# EAGLE design 2CAN (EAGLE 6.4)
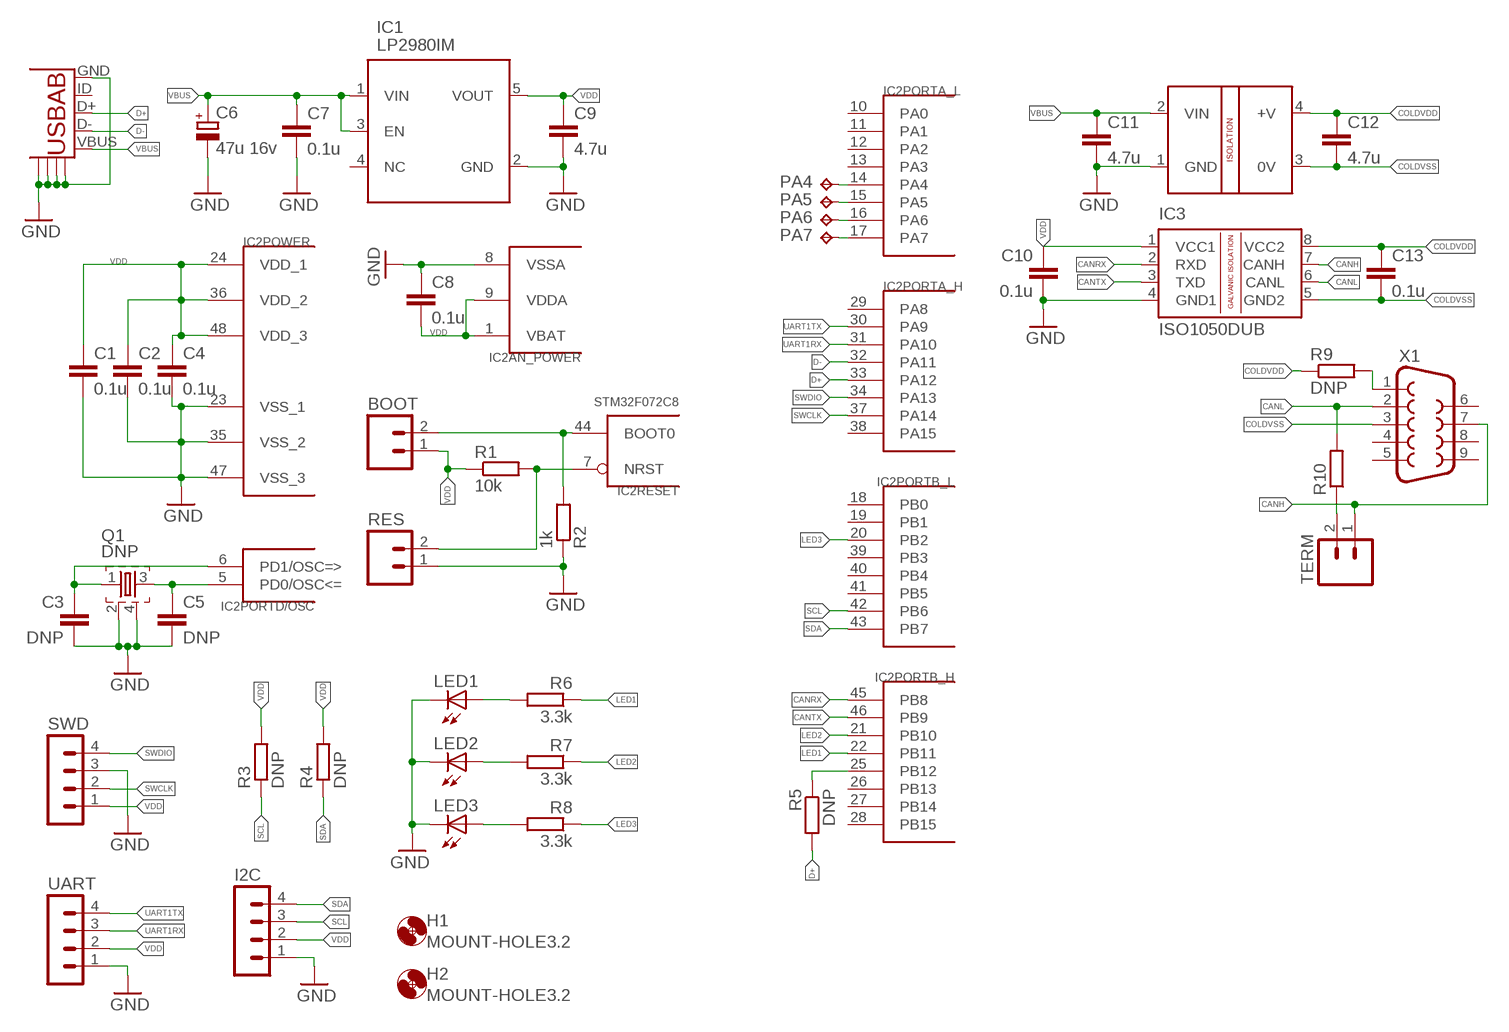
[diagram p0: schematic, sheet 1]

## Parts
BOOT  M02PTH  [1X02]
C1  0.1u  C-EUC0603  [C0603]
C2  0.1u  C-EUC0603  [C0603]
C3  DNP  C-EUC0603  [C0603]
C4  0.1u  C-EUC0603  [C0603]
C5  DNP  C-EUC0603  [C0603]
C6  47u 16v  CPOL-EUE2-5  [E2-5]
C7  0.1u  C-EUC0603  [C0603]
C8  0.1u  C-EUC0603  [C0603]
C9  4.7u  C-EUC0805  [C0805]
C10  0.1u  C-EUC0603  [C0603]
C11  4.7u  C-EUC0805  [C0805]
C12  4.7u  C-EUC0805  [C0805]
C13  0.1u  C-EUC0603  [C0603]
H1  MOUNT-HOLE3.2  [3,2]
H2  MOUNT-HOLE3.2  [3,2]
I2C  MA04-1  [MA04-1]
IC1  LP2980IM  [SOT23-5L]
IC2  STM32F072C8  STM32F10XCXT6  [TQFP48]
IC3  ISO1050DUB  [DUB-R-PDSO-G8]
LED1  LEDSML0603  [SML0603]
LED2  LEDSML0603  [SML0603]
LED3  LEDSML0603  [SML0603]
PA4  TPB1,27  [B1,27]
PA5  TPB1,27  [B1,27]
PA6  TPB1,27  [B1,27]
PA7  TPB1,27  [B1,27]
Q1  DNP  FA-3225  [FA-20H]
R1  10k  R-EU_R0603  [R0603]
R2  1k  R-EU_R0603  [R0603]
R3  DNP  R-EU_R0603  [R0603]
R4  DNP  R-EU_R0603  [R0603]
R5  DNP  R-EU_R0603  [R0603]
R6  3.3k  R-EU_R0603  [R0603]
R7  3.3k  R-EU_R0603  [R0603]
R8  3.3k  R-EU_R0603  [R0603]
R9  DNP  R-EU_R0805  [R0805]
R10  R-EU_R0805  [R0805]
RES  M02PTH  [1X02]
SWD  MA04-1  [MA04-1]
TERM  M02PTH  [1X02]
U$1  USB_AB  [USB-AB-MICRO-SMD]
U$2  B0505SV  [B0505S_V]
UART  MA04-1  [MA04-1]
X1  DB9MALE  [DB9_MALE]

## Nets
CANH: IC3.7(CANH) TERM.1 X1.7
CANL: IC3.6(CANL) R10.2 X1.2
CANRX: IC2.45(PORTB_H:PB8) IC3.2(RXD)
CANTX: IC2.46(PORTB_H:PB9) IC3.3(TXD)
COLDVDD: C12.1 C13.1 IC3.8(VCC2) R9.1 U$2.4(+V)
COLDVSS: C12.2 C13.2 IC3.5(GND2) U$2.3(0V) X1.3
D+: IC2.33(PORTA_H:PA12) R5.2 U$1.D+
D-: IC2.32(PORTA_H:PA11) U$1.D-
GND: C1.2 C2.2 C3.2 C4.2 C5.2 C6.- C7.2 C8.1 C9.2 C10.2 C11.2 I2C.1 IC1.2(GND) IC2.8(AN_POWER:VSSA) IC2.23(POWER:VSS_1) IC2.35(POWER:VSS_2) IC2.47(POWER:VSS_3) IC3.4(GND1) LED1.C LED2.C LED3.C Q1.2 Q1.4 R2.1 RES.1 SWD.3 U$1.GND U$1.GND@1 U$1.GND@2 U$1.GND@3 U$1.GND@4 U$2.1(GND) UART.1
LED1: IC2.22(PORTB_H:PB11) R6.1
LED2: IC2.21(PORTB_H:PB10) R7.1
LED3: IC2.20(PORTB_L:PB2) R8.1
N$1: IC2.7(RESET:NRST) R1.2 RES.2
N$2: BOOT.2 IC2.44(RESET:BOOT0) R2.2
N$3: R9.2 X1.1
N$4: LED1.A R6.2
N$5: LED2.A R7.2
N$6: LED3.A R8.2
N$8: R10.1 TERM.2
N$12: C5.1 IC2.5(PORTD/OSC:PD0/OSC<=) Q1.3
N$13: C3.1 IC2.6(PORTD/OSC:PD1/OSC=>) Q1.1
N$15: IC2.14(PORTA_L:PA4) PA4.TP
N$16: IC2.15(PORTA_L:PA5) PA5.TP
N$17: IC2.16(PORTA_L:PA6) PA6.TP
N$18: IC2.17(PORTA_L:PA7) PA7.TP
SCL: I2C.3 IC2.42(PORTB_L:PB6) R3.1
SDA: I2C.4 IC2.43(PORTB_L:PB7) R4.1
SWCLK: IC2.37(PORTA_H:PA14) SWD.2
SWDIO: IC2.34(PORTA_H:PA13) SWD.4
UART1RX: IC2.31(PORTA_H:PA10) UART.3
UART1TX: IC2.30(PORTA_H:PA9) UART.4
USBPU: IC2.25(PORTB_H:PB12) R5.1
VBUS: C6.+ C7.1 C11.1 IC1.1(VIN) IC1.3(EN) U$1.VBUS U$2.2(VIN)
VDD: BOOT.1 C1.1 C2.1 C4.1 C8.2 C9.1 C10.1 I2C.2 IC1.5(VOUT) IC2.1(AN_POWER:VBAT) IC2.9(AN_POWER:VDDA) IC2.24(POWER:VDD_1) IC2.36(POWER:VDD_2) IC2.48(POWER:VDD_3) IC3.1(VCC1) R1.1 R3.2 R4.2 SWD.1 UART.2
Unconnected: IC1.4(NC) IC2.2(PORTC:PC13) IC2.3(PORTC:PC14) IC2.4(PORTC:PC15) IC2.10(PORTA_L:PA0) IC2.11(PORTA_L:PA1) IC2.12(PORTA_L:PA2) IC2.13(PORTA_L:PA3) IC2.18(PORTB_L:PB0) IC2.19(PORTB_L:PB1) IC2.26(PORTB_H:PB13) IC2.27(PORTB_H:PB14) IC2.28(PORTB_H:PB15) IC2.29(PORTA_H:PA8) IC2.38(PORTA_H:PA15) IC2.39(PORTB_L:PB3) IC2.40(PORTB_L:PB4) IC2.41(PORTB_L:PB5) U$1.ID(USBID) X1.4 X1.5 X1.6 X1.8 X1.9

## Library data of the parts
BOOT RES TERM = untitled:M02: Standard 2-pin 0.1" header. Use with - straight break away headers ( PRT-00116) - right angle break away headers (PRT-00553) - swiss pins (PRT-00743) - machine pins (PRT-00117) - female headers (PRT-00115) Molex polarized connector foot print use with: PRT-08233 with associated crimp pins and housings. 2.54_SCREWTERM for use with PRT-10571. 3.5mm Screw Terminal footprints for PRT-08084 5mm Screw Terminal footprints for use with PRT-08433
C1-C5 C7-C13 = untitled:C-EU: CAPACITOR, European symbol
C6 = untitled:CPOL-EU: POLARIZED CAPACITOR, European symbol
H1 H2 = holes:MOUNT-HOLE: MOUNTING HOLE with drill center marker
I2C SWD UART = untitled:MA04-1: PIN HEADER; OC_FARNELL: unknown; OC_NEWARK: unknown
IC1 = untitled:LP2980
IC2 = untitled:STM32F10XCXT6: ST STM32F101/103 48pin LQFP
IC3 = texas:ISO1050: ISOLATED CAN TRANSCEIVER Source: http://focus.ti.com/lit/ds/symlink/iso1050.pdf; MPN: ISO1050DUBR; OC_FARNELL: 1755712; OC_NEWARK: 14R9899
LED1-LED3 = led:LED: LED OSRAM: - CHIPLED LG R971, LG N971, LY N971, LG Q971, LY Q971, LO R971, LY R971 LH N974, LH R974 LS Q976, LO Q976, LY Q976 LO Q996 - Hyper CHIPLED LW Q18S LB Q993, LB Q99A, LB R99A - SideLED LS A670, LO A670, LY A670, LG A670, LP A670 LB A673, LV A673, LT A673, LW A673 LH A674 LY A675 LS A676, LA A676, LO A676, LY A676, LW A676 LS A679, LY A679, LG A679 - Hyper Micro SIDELED® LS Y876, LA Y876, LO Y876, LY Y876 LT Y87S - SmartLED LW L88C, LW L88S LB L89C, LB L89S, LG L890 LS L89K, LO L89K, LY L89K LS L896, LA L896, LO L896, LY L896 - TOPLED LS T670, LO T670, LY T670, LG T670, LP T670 LSG T670, LSP T670, LSY T670, LOP T670, LYG T670 LG T671, LOG T671, LSG T671 LB T673, LV T673, LT T673, LW T673 LH T674 LS T676, LA T676, LO T676, LY T676, LB T676, LH T676, LSB T676, LW T676 LB T67C, LV T67C, LT T67C, LS T67K, LO T67K, LY T67K, LW E67C LS E67B, LA E67B, LO E67B, LY E67B, LB E67C, LV E67C, LT E67C LW T67C LS T679, LY T679, LG T679 LS T770, LO T770, LY T770, LG T770, LP T770 LB T773, LV T773, LT T773, LW T773 LH T774 LS E675, LA E675, LY E675, LS T675 LS T776, LA T776, LO T776, LY T776, LB T776 LHGB T686 LT T68C, LB T68C - Hyper Mini TOPLED® LB M676 - Mini TOPLED Santana® LG M470 LS M47K, LO M47K, LY M47K Source: http://www.osram.convergy.de LUXEON: - LUMILED® LXK2-PW12-R00, LXK2-PW12-S00, LXK2-PW14-U00, LXK2-PW14-V00 LXK2-PM12-R00, LXK2-PM12-S00, LXK2-PM14-U00 LXK2-PE12-Q00, LXK2-PE12-R00, LXK2-PE12-S00, LXK2-PE14-T00, LXK2-PE14-U00 LXK2-PB12-K00, LXK2-PB12-L00, LXK2-PB12-M00, LXK2-PB14-N00, LXK2-PB14-P00, LXK2-PB14-Q00 LXK2-PR12-L00, LXK2-PR12-M00, LXK2-PR14-Q00, LXK2-PR14-R00 LXK2-PD12-Q00, LXK2-PD12-R00, LXK2-PD12-S00 LXK2-PH12-R00, LXK2-PH12-S00 LXK2-PL12-P00, LXK2-PL12-Q00, LXK2-PL12-R00 Source: www.luxeon.com KINGBRIGHT: KA-3528ASYC Source: www.kingbright.com
PA4-PA7 = testpad:TP: Test pad
Q1 = untitled:FA-: MHz RANGE CRYSTAL UNIT Source: Epson Toyocom
R1-R10 = untitled:R-EU_: RESISTOR, European symbol
U$1 = untitled:USB_AB: This is a USB AB connector that is compatible with USB OTG. i.e. this connector can serve as a host or device
U$2 = untitled:B0505S
X1 = untitled:DB9: DB9 Connector Standard DB9 (D-Sub 9) serial connector. Can be used for CAN bus as well as RS485 and RS232. Footprint production proven. Spark Fun Electronics SKU : PRT-00429

## Board
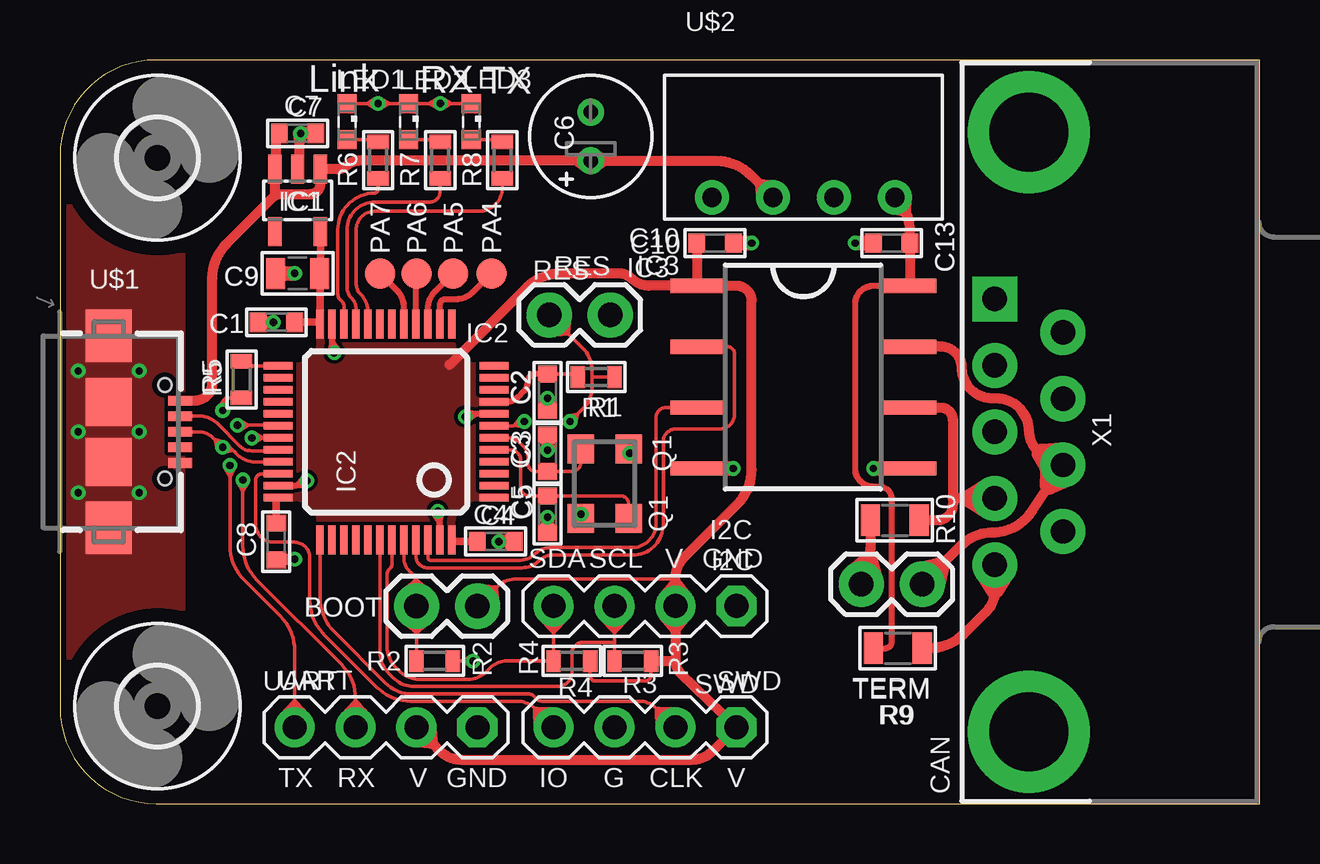
[diagram p1: board, top side]
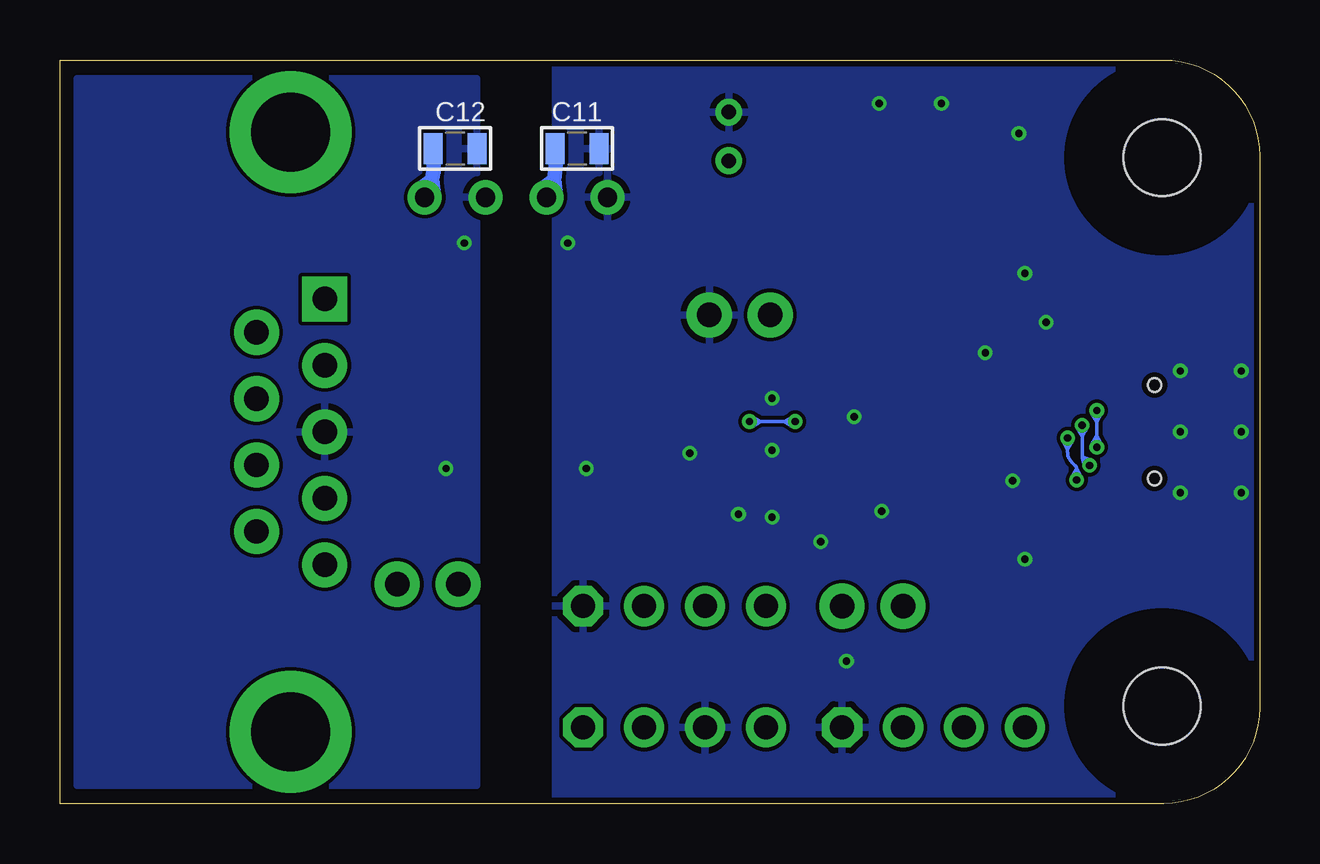
[diagram p2: board, bottom side, seen from below]

Size 50 x 31 mm. Coordinates in mm from the lower left corner, seen from the top.
Outline: 0,27 0,4 arc90 4,0 50,0 50,31 4,31 arc90 0,27
Copper layers (1*16): Top 0.035mm / dielectric 1.5mm / Bottom 0.035mm
Design rules "Fusion_eagle_rule_v1.1": minimum track width 6mil, minimum drill 12mil, track to track 6mil, track to pad 6mil, pad to pad 6mil, via to via 6mil, smd to smd 0mil, copper to edge 10mil, drill to drill 10mil, minimum pad ring 10mil, minimum via ring 6mil, stop-mask expansion 0mil, vias tented up to drill 100mil, thermal gap 10mil

### Footprints (pad centres in the part's own frame; a part is rotated, then mirrored left to right if it is on the bottom)
1X02 = drill 1.016 pad 1.88: 1 0,0; 2 2.54,0
C0603 = smd 0.7 x 0.8: 1 -0.762,0; 2 0.762,0
E2-5 = drill 0.61 pad 0.914: + -1.016,0; - 1.016,0
C0805 = smd 0.8 x 1.3: 1 -0.914,0; 2 0.914,0
3,2 = hole 3.2: 0,0
MA04-1 = drill 1 pad 1.676 octagon: 1 -3.81,0 | drill 1 pad 1.676: 2 -1.27,0; 3 1.27,0; 4 3.81,0
SOT23-5L = smd 0.55 x 1.2: 1 -0.95,-1.3; 2 0,-1.3; 3 0.95,-1.3; 4 0.95,1.3; 5 -0.95,1.3
TQFP48 = smd 0.305 x 1.219: 1 -2.75,-4.5; 2 -2.25,-4.5; 3 -1.75,-4.5; 4 -1.25,-4.5; 5 -0.75,-4.5; 6 -0.25,-4.5; 7 0.25,-4.5; 8 0.75,-4.5; 9 1.25,-4.5; 10 1.75,-4.5; 11 2.25,-4.5; 12 2.75,-4.5; 25 2.75,4.5; 26 2.25,4.5; 27 1.75,4.5; 28 1.25,4.5; 29 0.75,4.5; 30 0.25,4.5; 31 -0.25,4.5; 32 -0.75,4.5; 33 -1.25,4.5; 34 -1.75,4.5; 35 -2.25,4.5; 36 -2.75,4.5 | smd 1.219 x 0.305: 13 4.5,-2.75; 14 4.5,-2.25; 15 4.5,-1.75; 16 4.5,-1.25; 17 4.5,-0.75; 18 4.5,-0.25; 19 4.5,0.25; 20 4.5,0.75; 21 4.5,1.25; 22 4.5,1.75; 23 4.5,2.25; 24 4.5,2.75; 37 -4.5,2.75; 38 -4.5,2.25; 39 -4.5,1.75; 40 -4.5,1.25; 41 -4.5,0.75; 42 -4.5,0.25; 43 -4.5,-0.25; 44 -4.5,-0.75; 45 -4.5,-1.25; 46 -4.5,-1.75; 47 -4.5,-2.25; 48 -4.5,-2.75
DUB-R-PDSO-G8 = smd 0.6 x 2.2: 1 -3.81,-4.445; 2 -1.27,-4.445; 3 1.27,-4.445; 4 3.81,-4.445; 5 3.81,4.445; 6 1.27,4.445; 7 -1.27,4.445; 8 -3.81,4.445
SML0603 = smd 0.8 x 0.8: A 0.75,0; C -0.75,0
B1,27 = smd 1.27 x 1.27: TP 0,0
FA-20H = smd 1.2 x 1.1: 1 -1.45,-1; 2 1.45,-1; 3 1.45,1; 4 -1.45,1
R0603 = smd 0.6 x 0.9: 1 -0.762,0; 2 0.762,0
R0805 = smd 0.8 x 1.3: 1 -1.016,0; 2 1.016,0
USB-AB-MICRO-SMD = smd 1 x 0.4: D+ 2.469,0; D- 2.469,0.65; GND 2.469,-1.3; ID 2.469,-0.65; VBUS 2.469,1.3 | smd 1.9 x 2.2: GND@1 -0.508,4; GND@4 -0.508,-4 | smd 1.9 x 2: GND@2 -0.508,1.25; GND@3 -0.508,-1.25 | hole 0.55: 1.84,1.95; 1.84,-1.95
B0505S_V = drill 0.8 pad 1.422: 1 -3.81,0; 2 -1.27,0; 3 1.27,0; 4 3.81,0
DB9_MALE = drill 1.016 pad 1.88: 1 5.54,-1.42; 2 2.77,-1.42; 3 0,-1.42; 4 -2.77,-1.42; 6 4.15,1.42; 7 1.38,1.42; 8 -1.38,1.42; 9 -4.15,1.42 | drill 1.016 pad 1.88 square: 5 -5.54,-1.42 | drill 3.302 pad 5.08: G1 -12.5,0; G2 12.5,0

### Placement (x,y rotation side)
BOOT  17.4,8.23 180 top
C1  9.02,20.07 180 top
C2  20.32,17.14 270 top
C3  20.32,14.61 90 top
C4  18.16,10.92 0 top
C5  20.32,12.06 270 top
C6  22.12,27.81 90 top
C7  9.91,27.94 0 top
C8  9.02,10.92 90 top
C9  9.91,22.1 180 top
C10  27.3,23.37 0 top
C11  28.45,27.3 0 bottom
C12  33.53,27.3 0 bottom
C13  34.67,23.37 180 top
H1  4.06,4.06 0 top
H2  4.06,26.92 0 top
I2C  24.38,8.23 180 top
IC1  9.91,25.15 180 top
IC2  13.59,15.49 90 top
IC3  30.99,17.78 270 top
LED1  11.96,28.42 270 top
LED2  14.53,28.42 270 top
LED3  17.14,28.42 270 top
PA4  17.98,22.1 90 top
PA5  16.38,22.1 90 top
PA6  14.86,22.1 90 top
PA7  13.34,22.1 90 top
Q1  22.71,13.34 270 top
R1  22.35,17.78 0 top
R2  15.62,5.94 180 top
R3  23.88,5.94 0 top
R4  21.34,5.94 0 top
R5  7.57,17.68 270 top
R6  13.26,26.82 90 top
R7  15.85,26.82 90 top
R8  18.44,26.82 90 top
R9  34.92,6.48 0 top
R10  34.8,11.81 0 top
RES  22.94,20.37 180 top
SWD  24.38,3.17 180 top
TERM  35.94,9.14 180 top
U$1  2.54,15.5 0 top
U$2  30.99,25.27 0 top
UART  13.59,3.17 180 top
X1  40.39,15.49 270 top

### Tracks (layer width: path | path; a pad name or v marks a point on that pad's centre or on a via)
CANH
  Top 0.406: IC3.7 36.7,19.05 arc-90 37.59,18.16 arc90 38.86,16.89 39.03,16.89 arc-90 40.39,15.53 arc72 41.15,14.48 arc-21 X1.7 arc1 40.51,12.19 arc-57 38.86,11.3 arc45 37.56,10.76 36.66,9.86 TERM.1
  Top 0.813: X1.7 42.02,13.62 41.23,13.27 41.27,14.14 X1.7 | X1.7 41.35,13.84 40.91,14.59 41.77,14.65 X1.7 | 36.66,9.86 35.82,9.66 TERM.1 36.46,9.02 36.66,9.86
CANL
  Top 0.406: IC3.6 36.7,16.51 arc-90 37.21,16 37.21,12.7 | 37.21,12.7 37.21,12.45 arc-90 36.58,11.81 R10.2 | X1.2 37.95,12.72 37.23,12.72 arc90 37.21,12.7
  Top 0.813: 37.95,12.72 38.69,12.27 X1.2 38.69,13.18 37.95,12.72
CANRX
  Top 0.152: IC2.45 14.84,10.31 arc90 15.32,9.83 19.27,9.83 arc45 19.98,10.12 arc-45 20.56,10.36 23.88,10.36 arc90 25.15,11.63 25.15,15.09 arc-90 25.68,15.62 27.51,15.62 arc90 28.12,16.23 28.12,18.75 arc90 27.81,19.05 IC3.2
CANTX
  Top 0.152: IC2.46 15.34,10.26 arc90 15.47,10.13 19.12,10.13 arc45 19.82,10.43 arc-45 20.41,10.67 23.84,10.67 arc90 24.84,11.67 24.84,16.08 arc-90 25.27,16.51 IC3.3
COLDVDD
  Top 0.254: R9.1 34.42,6.48 arc90 34.67,6.73 34.67,12.7 arc90 34.16,13.21 33.91,13.21 arc-90 33.15,13.97 33.15,20.83 arc-90 33.91,21.59 IC3.8
  Top 0.406: U$2.4 arc-49 35.43,23.88 C13.1 IC3.8 | U$2.4 35.3,25.25 35.27,24.63 34.67,24.78 U$2.4
  Bottom 0.61: C12.1 34.42,27.3 34.42,26.67 arc14 34.5,26.01 | 34.5,26.01 arc17 U$2.4 | 34.5,26.01 34.4,25.33 U$2.4 | 34.5,26.01 35.04,25.6 U$2.4
COLDVSS  (via drill 0.3 pad 0.61)
  Top 0.61: v33.15,23.37 C13.2 | v33.91,13.97 IC3.5
  pour Bottom: 37.08,30.23 32.64,30.23 32.64,19.68 32.64,0.76 36.7,0.76 49.28,0.76 49.28,29.46 49.28,30.23
D+  (via drill 0.3 pad 0.61)
  Top 0.152: v6.78,14.86 arc-36 7.22,14.72 | 7.22,14.72 arc-9 7.3,14.64 7.41,14.54 arc45 8.12,14.24 IC2.33 | U$1.D+ 5.73,15.5 arc-45 6.43,15.21 6.46,15.18 | 6.46,15.18 v6.78,14.86 | v6.78,16.38 6.78,16.69 arc-41 6.84,16.84 | 7.32,16.92 R5.2 7.01,16.92 arc49 6.84,16.84 | 6.84,16.84 6.6,16.52 v6.78,16.38 | 6.84,16.84 6.99,16.47 v6.78,16.38 | 7.22,14.72 6.95,15.01 v6.78,14.86 | 7.22,14.72 6.83,14.63 v6.78,14.86 | 6.46,15.18 6.56,14.8 v6.78,14.86 | 6.46,15.18 6.84,15.08 v6.78,14.86
  Bottom 0.152: v6.78,16.38 6.78,15.93 | 6.78,15.93 6.78,15.32 | 6.78,15.32 v6.78,14.86 | 6.78,15.93 6.98,16.27 v6.78,16.38 | 6.78,15.93 6.58,16.27 v6.78,16.38 | 6.78,15.32 6.58,14.97 v6.78,14.86 | 6.78,15.32 6.98,14.97 v6.78,14.86
D-
  Top 0.152: U$1.D- 5.84,16.15 arc-45 6.55,15.86 7.51,14.89 arc45 7.96,14.71 9.09,14.71 IC2.32
GND  (via drill 0.3 pad 0.61)
  Top 0.152: v17.22,5.94 16.76,5.94 | 16.76,5.94 R2.1 | Q1.4 v23.75,14.61 | v21.72,12.06 Q1.2 | LED1.C 11.96,29.18 12.8,29.18 | 12.8,29.18 v13.26,29.18 | 14.53,29.18 13.72,29.18 | 13.72,29.18 v13.26,29.18 | LED2.C 14.53,29.18 | 14.53,29.18 15.39,29.18 | 15.39,29.18 v15.85,29.18 | LED3.C 17.14,29.18 16.31,29.18 | 16.31,29.18 v15.85,29.18 | 16.76,5.94 17.11,5.75 v17.22,5.94 | 16.76,5.94 17.11,6.14 v17.22,5.94 | 12.8,29.18 13.14,28.99 v13.26,29.18 | 12.8,29.18 13.14,29.38 v13.26,29.18 | 13.72,29.18 13.37,29.38 v13.26,29.18 | 13.72,29.18 13.37,28.99 v13.26,29.18 | 15.39,29.18 15.73,28.99 v15.85,29.18 | 15.39,29.18 15.73,29.38 v15.85,29.18 | 16.31,29.18 15.96,29.38 v15.85,29.18 | 16.31,29.18 15.96,28.99 v15.85,29.18
  Top 0.254: IC2.8 17.4,16.24 arc26 v16.89,16.13 | IC2.47 15.84,11.56 arc16 v15.75,12.19 | IC2.35 9.65,13.24 arc38 v10.29,13.46 | IC2.23 11.34,19.3 arc20 v11.43,18.8 | v15.75,12.19 15.92,12.15 15.83,11.74 15.6,12.09 v15.75,12.19 | v10.29,13.46 10.29,13.28 9.87,13.27 10.15,13.58 v10.29,13.46 | v11.43,18.8 11.26,18.83 11.34,19.24 11.58,18.9 v11.43,18.8 | v16.89,16.13 16.92,16.3 17.33,16.24 17,15.99 v16.89,16.13
  Top 0.406: v8.89,20.07 8.43,20.07 | 8.43,20.07 C1.2 | C5.2 20.32,11.48 | 20.32,11.48 v20.32,11.94 | v18.29,10.92 18.75,10.92 | 18.75,10.92 C4.2 | v20.32,14.73 20.32,15.19 | 20.32,15.19 C3.2 | v20.32,16.89 20.32,16.43 | 20.32,16.43 C2.2 | v10.03,27.94 10.49,27.94 | 10.49,27.94 C7.2 | IC1.2 9.98,26.45 9.98,27.49 | 9.98,27.49 9.98,27.94 v10.03,27.94 | v9.78,10.19 9.32,10.19 | 9.32,10.19 9.04,10.19 arc90 C8.1 | 9.32,10.19 9.76,10.09 v9.78,10.19 | 9.32,10.19 9.76,10.28 v9.78,10.19 | 8.43,20.07 8.87,19.97 v8.89,20.07 | 8.43,20.07 8.87,20.16 v8.89,20.07 | 18.75,10.92 18.31,11.02 v18.29,10.92 | 18.75,10.92 18.31,10.82 v18.29,10.92 | 20.32,11.48 20.42,11.91 v20.32,11.94 | 20.32,11.48 20.22,11.91 v20.32,11.94 | 20.32,15.19 20.22,14.76 v20.32,14.73 | 20.32,15.19 20.42,14.76 v20.32,14.73 | 20.32,16.43 20.42,16.87 v20.32,16.89 | 20.32,16.43 20.22,16.87 v20.32,16.89 | 10.49,27.94 10.06,28.04 v10.03,27.94 | 10.49,27.94 10.06,27.84 v10.03,27.94 | 9.98,27.49 10.13,27.91 v10.03,27.94 | 9.98,27.49 9.93,27.93 v10.03,27.94
  Top 0.61: v28.83,23.37 C10.2 | v28.07,13.97 IC3.4 | v9.78,22.1 C9.2
  other vias: 0.76,15.49 0.76,18.03 0.76,12.95 3.3,12.95 3.3,15.49 3.3,18.03
  pour Bottom: 17.14,30.86 29.34,30.86 29.34,18.41 29.34,0.13 20.7,0.13 0.13,0.13 0.13,25.4 0.13,30.86
  pour Top (no thermals): 5.08,26.92 5.08,4.06 0.13,4.06 0.13,26.92
LED1
  Top 0.152: IC2.22 11.84,20.72 arc45 11.75,20.94 11.68,21.01 arc-45 11.58,21.24 11.58,23.93 arc-90 13.11,25.45 arc90 13.26,25.6 R6.1
LED2
  Top 0.152: IC2.21 12.34,20.62 arc45 12.15,21.07 12.15,21.07 arc-45 11.96,21.52 11.96,23.93 arc-90 13.11,25.07 15.39,25.07 arc90 15.85,25.53 R7.1
LED3
  Top 0.152: IC2.20 12.84,20.5 arc45 12.55,21.21 arc-45 12.34,21.7 12.34,23.93 arc-90 13.11,24.69 17.45,24.69 arc90 18.44,25.68 R8.1
N$1  (via drill 0.3 pad 0.61)
  Top 0.152: IC2.7 18.79,15.74 arc8 18.93,15.75 | v21.26,15.93 21.58,16.25 | 21.58,16.25 21.8,16.47 arc45 22.17,17.37 22.17,17.75 | 22.17,17.75 22.17,18.07 arc45 21.8,18.96 21.11,19.65 RES.2 | R1.2 22.2,17.78 22.17,17.75 | 18.93,15.75 arc27 v19.36,15.93 | 18.93,15.75 19.32,15.7 v19.36,15.93 | 18.93,15.75 19.18,16.07 v19.36,15.93 | 21.58,16.25 21.2,16.15 v21.26,15.93 | 21.58,16.25 21.48,15.87 v21.26,15.93
  Top 0.305: 21.11,19.65 21.18,20.29 RES.2 20.48,19.59 21.11,19.65
  Bottom 0.152: v19.36,15.93 19.81,15.93 | 19.81,15.93 20.8,15.93 | 20.8,15.93 v21.26,15.93 | 19.81,15.93 19.47,16.12 v19.36,15.93 | 19.81,15.93 19.47,15.73 v19.36,15.93 | 20.8,15.93 21.14,15.73 v21.26,15.93 | 20.8,15.93 21.14,16.12 v21.26,15.93
N$2
  Top 0.152: R2.2 14.86,7.21 BOOT.2 14.86,9.16 arc50 14.64,9.64 14.56,9.7 arc-50 14.34,10.19 IC2.44
  Top 0.305: BOOT.2 15.36,7.62 14.86,7.21 14.36,7.62 BOOT.2 | BOOT.2 14.36,8.84 14.85,9.25 15.35,8.84 BOOT.2
N$3
  Top 0.406: R9.2 36.26,6.48 arc45 37.67,7.06 38.59,7.99 arc45 38.97,8.88 38.97,8.94 X1.1
  Top 0.813: 38.97,8.94 39.42,9.67 X1.1 38.51,9.67 38.97,8.94
N$4
  Top 0.152: R6.2 13.26,27.67 LED1.A
N$5
  Top 0.152: R7.2 15.85,27.67 LED2.A
N$6
  Top 0.152: R8.2 18.44,27.67 LED3.A
N$8
  Top 0.406: R10.1 33.78,10.92 arc-11 33.71,10.11 arc-13 TERM.2
  Top 0.813: 33.71,10.11 33.05,9.55 TERM.2 33.92,9.28 33.71,10.11
N$12
  Top 0.152: Q1.3 23.71,12.49 arc90 23.37,12.83 C5.1 19.56,12.83 arc-90 19.2,13.18 19.2,14.35 arc45 19.11,14.57 19.03,14.65 arc45 18.8,14.74 IC2.5
N$13
  Top 0.152: Q1.1 21.71,14.21 arc-90 21.34,13.84 C3.1 19.84,13.84 arc-90 19.51,14.17 19.51,14.44 arc45 19.32,14.89 19.16,15.06 arc45 18.71,15.24 IC2.6
N$15
  Top 0.254: PA4.TP 17.21,21.32 arc-45 16.5,21.03 16.08,21.03 arc90 15.84,20.79 IC2.14
N$16
  Top 0.254: IC2.15 15.34,20.64 arc-45 15.63,21.35 PA5.TP
N$17
  Top 0.254: IC2.16 14.84,22 PA6.TP
N$18
  Top 0.254: IC2.17 14.34,20.68 arc45 14.05,21.39 PA7.TP
SCL
  Top 0.152: R3.1 23.11,6.72 | 23.11,6.72 23.11,7.23 I2C.3 | 23.11,6.72 21.81,6.72 arc90 21.34,6.25 21.34,5.49 arc-90 20.73,4.88 14.78,4.88 arc-45 13.88,5.25 13.71,5.42 arc-45 13.34,6.32 IC2.42 arc-90 IC2.42
  Top 0.305: 23.11,7.23 23.61,7.76 I2C.3 22.61,7.76 23.11,7.23
SDA
  Top 0.152: I2C.4 20.57,7.23 R4.1 18.63,5.94 arc45 17.92,5.65 17.74,5.47 arc-45 17.04,5.18 15,5.18 arc-45 14.11,5.55 14.01,5.65 arc-45 13.64,6.55 13.64,9.57 arc-45 13.71,9.75 13.77,9.8 arc45 13.84,9.98 IC2.43
  Top 0.305: 20.57,7.23 21.07,7.76 I2C.4 20.07,7.76 20.57,7.23
SWCLK
  Top 0.152: IC2.37 10.84,8.58 arc45 11.43,7.17 13.57,5.02 arc45 14.65,4.57 19.53,4.57 arc-45 19.75,4.48 19.87,4.36 arc45 20.1,4.27 24.15,4.27 arc-45 24.86,3.97 24.95,3.88 SWD.2
  Top 0.305: 24.95,3.88 24.97,3.15 SWD.2 25.67,3.86 24.95,3.88
SWDIO
  Top 0.152: IC2.34 8.41,13.74 arc90 8.15,13.49 8.15,11.66 arc90 8.91,10.9 9.78,10.9 arc-90 10.41,10.26 10.41,8.47 arc45 11,7.06 13.21,4.85 arc45 14.62,4.27 19.07,4.27 arc-45 19.77,3.97 19.87,3.88 SWD.4
  Top 0.305: 19.87,3.88 19.89,3.15 SWD.4 20.59,3.86 19.87,3.88
UART1RX  (via drill 0.3 pad 0.61)
  Top 0.152: IC2.31 8.46,15.24 | 8.46,15.24 v8.01,15.24 v8,15.24 | v7.62,13.49 7.62,13.03 | 7.62,13.03 7.62,10.73 arc45 8.21,9.32 11.73,5.79 arc-45 12.32,4.38 12.32,4.17 UART.3 | 8.46,15.24 8.11,15.44 v8,15.24 | 8.46,15.24 8.12,15.04 v8,15.24 | 7.62,13.03 7.82,13.37 v7.62,13.49 | 7.62,13.03 7.42,13.37 v7.62,13.49
  Top 0.305: 12.32,4.17 11.82,3.65 UART.3 12.82,3.65 12.32,4.17
  Bottom 0.152: v8,15.24 8,14.78 | 8,14.78 8,14.66 arc-45 7.82,14.22 7.67,14.07 arc45 7.62,13.95 | 7.62,13.95 v7.62,13.49 | 8,14.78 8.2,15.13 v8,15.24 | 8,14.78 7.8,15.13 v8,15.24 | 7.62,13.95 7.42,13.6 v7.62,13.49 | 7.62,13.95 7.82,13.6 v7.62,13.49
UART1TX  (via drill 0.3 pad 0.61)
  Top 0.152: IC2.30 9.06,15.77 7.85,15.77 | 7.85,15.77 v7.39,15.77 | v7.09,14.1 7.09,13.64 | 7.09,13.64 7.09,10.73 arc45 7.67,9.32 9.19,7.8 arc-45 9.78,6.38 9.78,4.17 UART.4 | 7.85,15.77 7.51,15.97 v7.39,15.77 | 7.85,15.77 7.51,15.57 v7.39,15.77 | 7.09,13.64 7.29,13.98 v7.09,14.1 | 7.09,13.64 6.89,13.98 v7.09,14.1
  Top 0.305: 9.78,4.17 9.28,3.65 UART.4 10.28,3.65 9.78,4.17
  Bottom 0.152: v7.39,15.77 7.39,15.32 | 7.39,15.32 7.39,14.44 | 7.39,14.44 arc-45 7.37,14.38 v7.09,14.1 | 7.39,15.32 7.59,15.66 v7.39,15.77 | 7.39,15.32 7.19,15.66 v7.39,15.77 | 7.39,14.44 7.01,14.31 v7.09,14.1 | 7.39,14.44 7.31,14.05 v7.09,14.1
USBPU
  Top 0.152: IC2.25 7.61,18.24 arc-90 R5.1
VBUS
  Top 0.406: C6.+ 22.73,26.8 | 22.73,26.8 27.37,26.8 arc-45 28.78,26.21 29.15,25.84 | 29.15,25.84 U$2.2 | U$1.VBUS 5.62,16.8 arc90 6.35,17.53 6.35,21.91 arc-45 6.94,23.32 8.96,25.34 8.96,25.4 | 8.96,25.4 IC1.3 arc90 9.02,26.51 9.02,27.94 C7.1 | 8.96,25.4 10.41,25.4 arc90 10.86,25.84 IC1.1 11.57,26.44 arc45 11.98,26.61 arc-45 12.43,26.8 21.51,26.8 | C6.+ 21.51,26.8 | 22.73,26.8 22.33,27.09 C6.+ | 22.73,26.8 22.33,26.51 C6.+ | 21.51,26.8 21.92,26.51 C6.+ | 21.51,26.8 21.92,27.09 C6.+ | 29.15,25.84 29.21,25.22 U$2.2 | 29.15,25.84 29.77,25.78 U$2.2
  Bottom 0.61: C11.1 29.34,27.28 29.34,26.67 arc14 29.42,26.01 | 29.42,26.01 arc17 U$2.2 | 29.42,26.01 29.32,25.33 U$2.2 | 29.42,26.01 29.96,25.6 U$2.2
VDD
  Top 0.152: R3.2 24.64,5.36 arc-90 24.38,5.11 22.33,5.11 arc-90 22.1,5.33 R4.2 | BOOT.1 18.12,8.95 18.17,9 arc-45 19.07,9.37 25.65,9.37 | C2.1 21.46,17.91 arc-90 R1.1
  Top 0.254: IC2.9 18.61,16.74 arc45 19.06,16.93 19.35,17.21 arc45 19.51,17.6 arc-90 19.81,17.91 C2.1
  Top 0.305: C8.2 9.02,12.74 IC2.36 | C4.1 16.34,10.92 IC2.48 | C1.1 10.84,20.07 IC2.24 10.84,22.1 C9.1 10.86,22.1 IC1.5 | 18.12,8.95 17.48,9.01 BOOT.1 18.18,8.31 18.12,8.95
  Top 0.406: UART.2 15.57,2.47 | 15.57,2.47 15.83,2.2 arc45 16.73,1.83 26.32,1.83 arc45 27.22,2.2 SWD.1 25.87,5.43 arc-46 25.65,5.94 | I2C.2 25.65,7.23 | 25.65,7.23 25.65,5.94 | C10.1 IC3.1 | R3.2 25.65,5.94 | I2C.2 25.65,9.23 | 25.65,9.23 25.65,9.37 25.65,9.38 arc-45 26.03,10.28 28.24,12.49 arc45 28.83,13.91 28.83,20.95 arc90 28.19,21.59 IC3.1 | IC3.1 24.54,21.59 arc-45 23.84,21.88 arc45 23.32,22.1 20.87,22.1 arc45 19.45,21.51 16.23,18.29 | 15.57,2.47 15.49,3.24 UART.2 | 15.57,2.47 14.8,2.54 UART.2 | 25.65,7.23 26.14,7.83 I2C.2 | 25.65,7.23 25.16,7.83 I2C.2 | 25.65,9.23 25.16,8.63 I2C.2 | 25.65,9.23 26.14,8.63 I2C.2
  pour Top (no thermals): 10.77,20.52 10.77,19.31 arc-90 9.77,18.31 8.56,18.31 8.56,12.67 9.77,12.67 arc-90 10.77,11.67 10.77,10.46 16.41,10.46 16.41,11.67 arc-90 17.41,12.67 18.62,12.67 18.62,18.31 17.41,18.31 arc-90 16.41,19.31 16.41,20.52

### Text on the board
_tNames: Link | RX | TX | C7 | C6 | IC1 | R6 | R7 | R8 | C10 | C13 | PA7 | PA6 | PA5 | PA4 | IC3 | C9 | RES | C1 | IC2 | R5 | C2 | R1 | C3 | Q1 | C4 | C5 | I2C | R10 | C8 | SDA | SCL | V | GND | BOOT | R2 | UART | R4 | R3 | SWD | TERM | R9 | TX | RX | V | GND | IO | G | CLK | V | CAN
_bNames: C11 | C12
_tValues: LP2980IM | B0505SV | USB_AB | TPB1,27 | TPB1,27 | TPB1,27 | TPB1,27 | FA-3225 | STM32F10XCXT6 | ISO1050DUB